# EAGLE design Rear ECU rev6 (EAGLE 9.1.3)
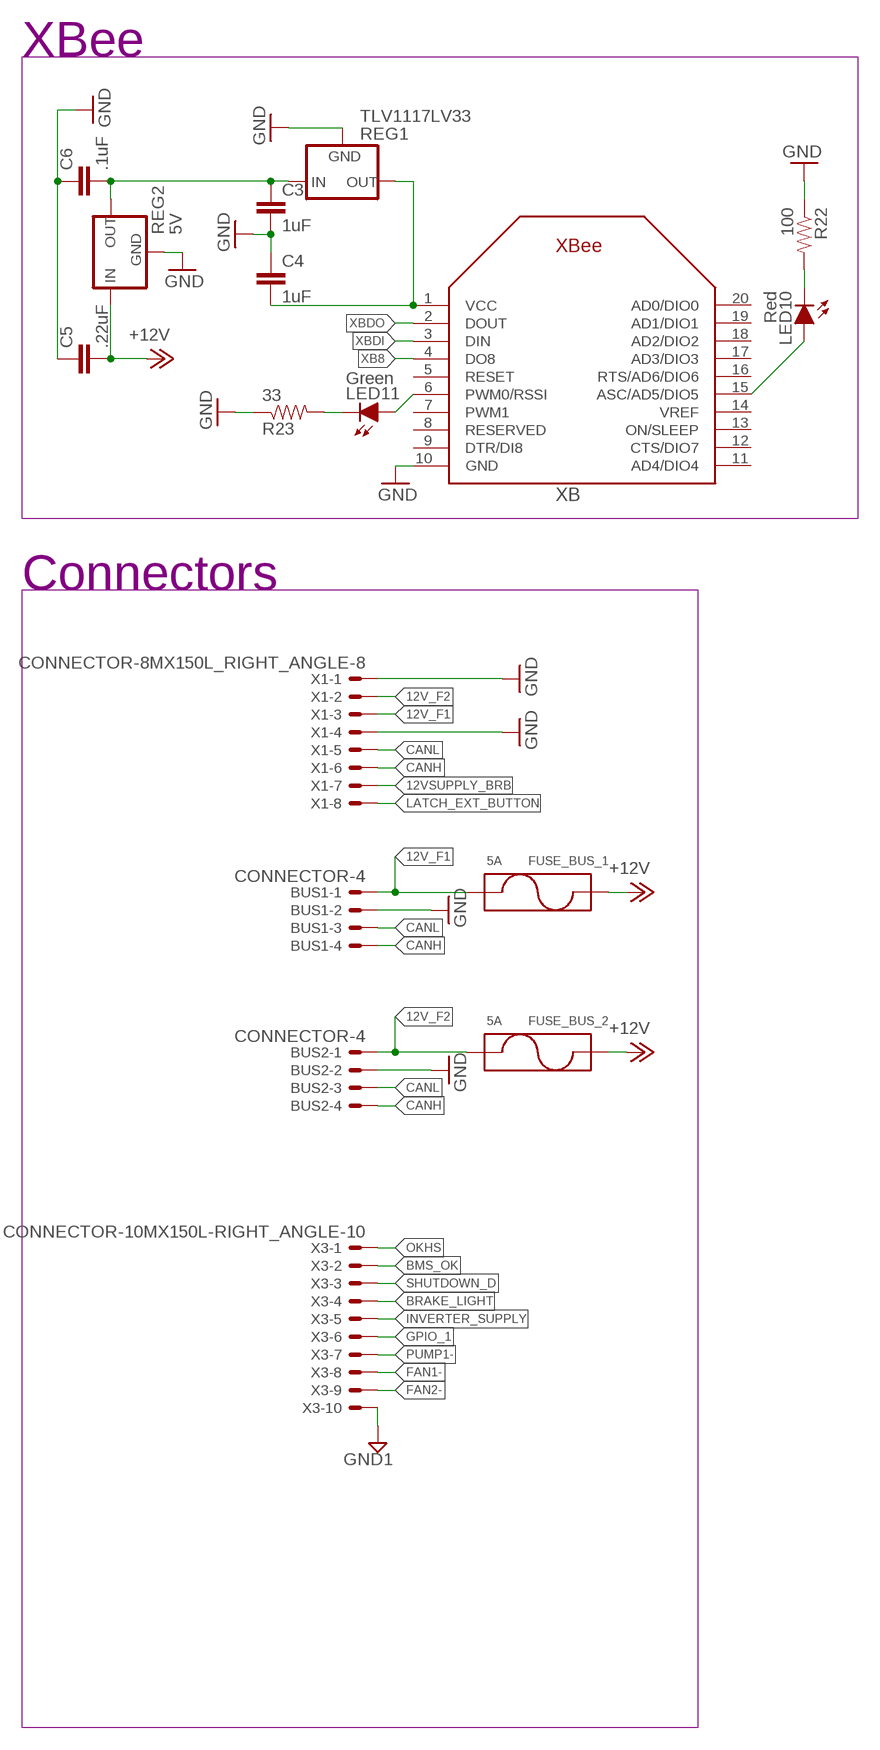
[diagram p0: schematic, sheet 1, part 1 of 2]
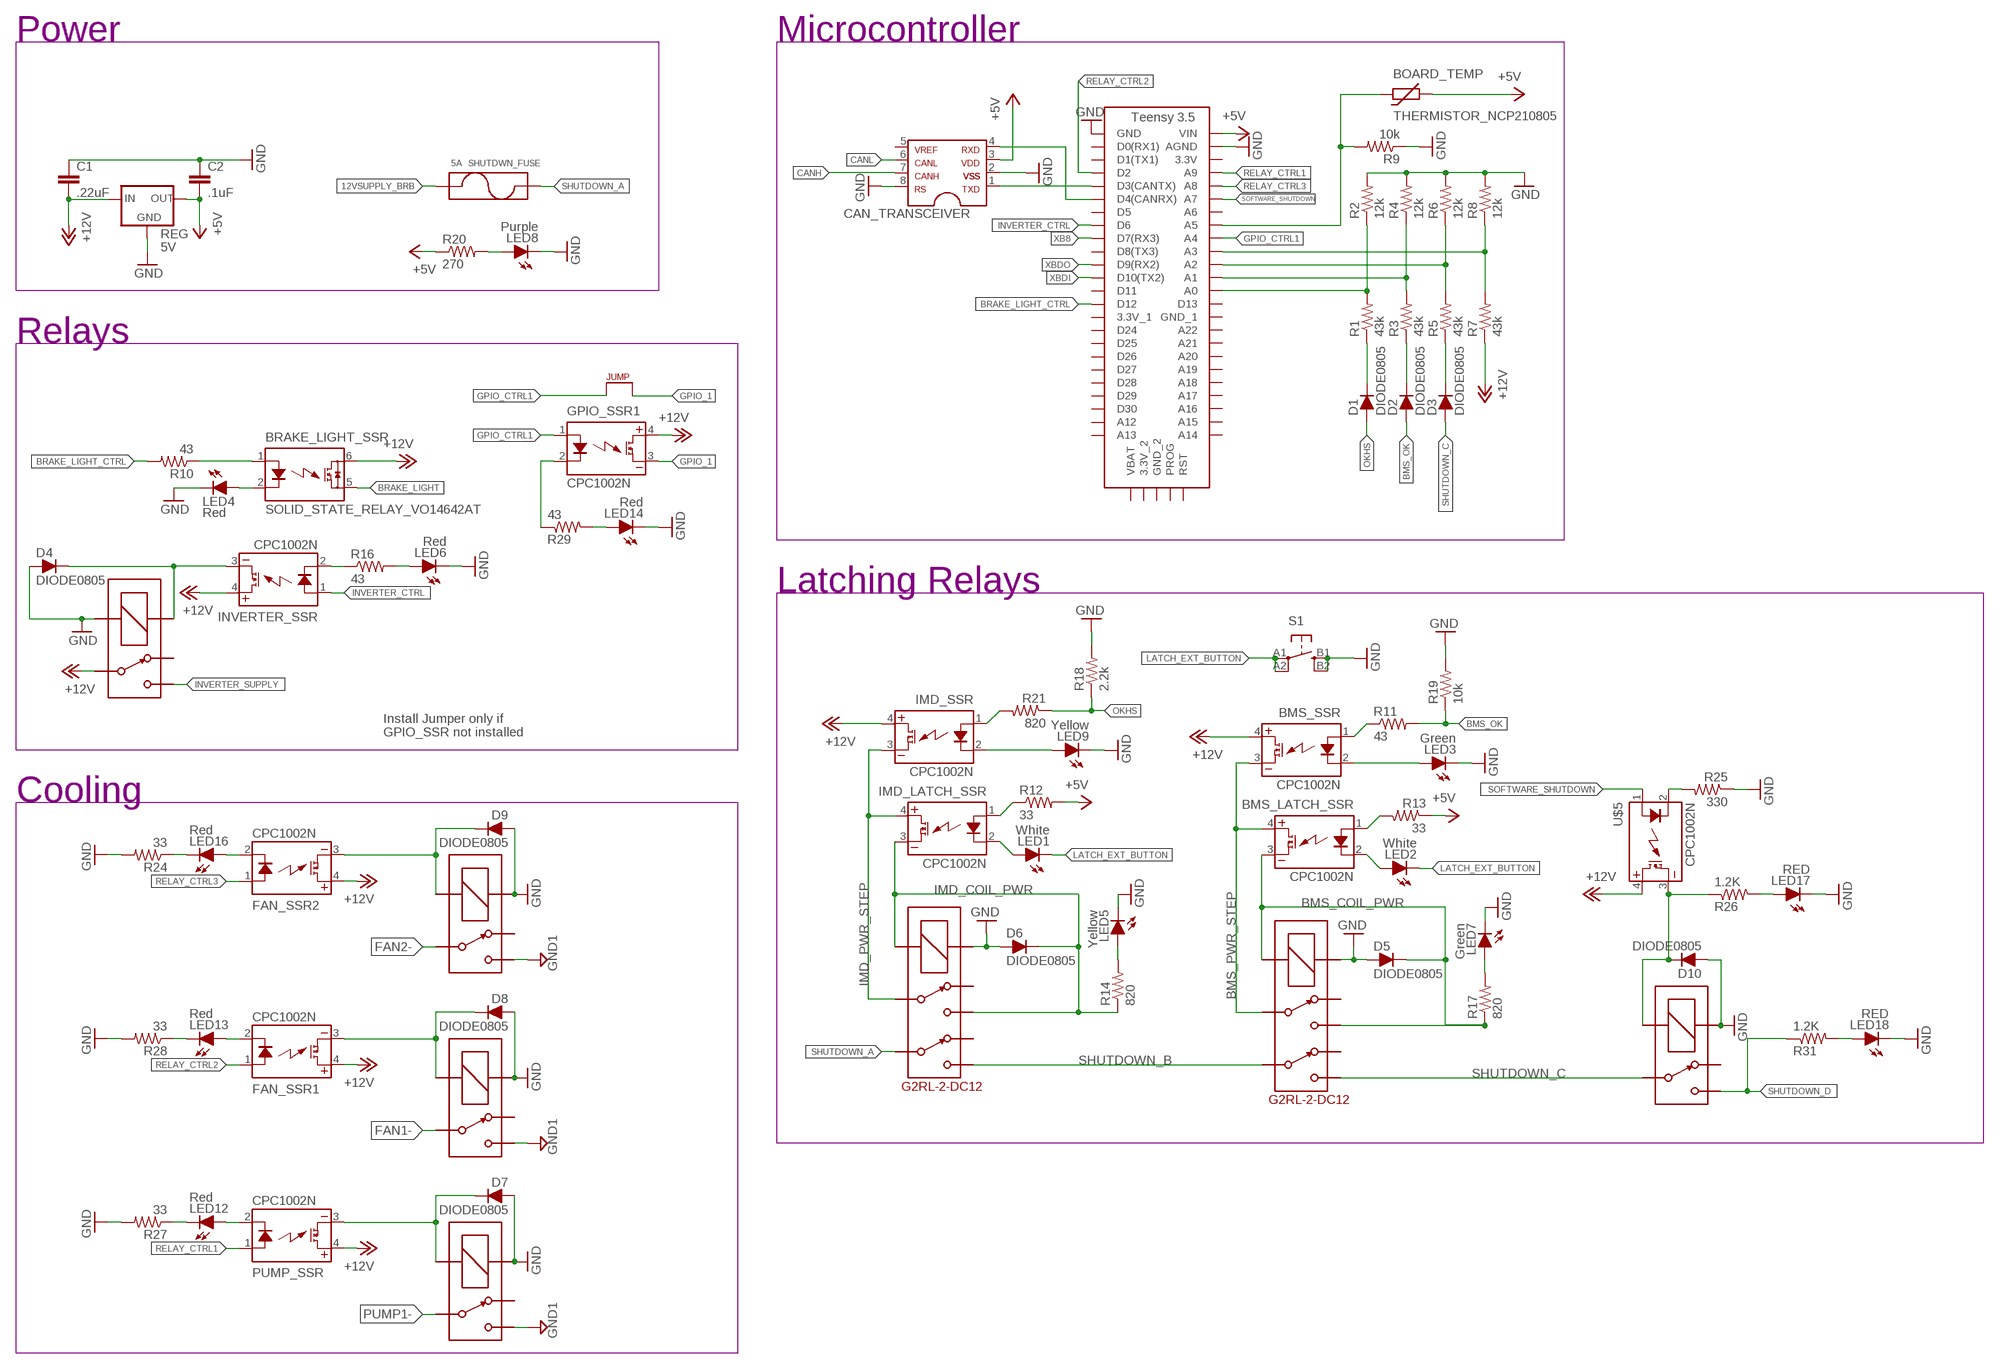
[diagram p1: schematic, sheet 1, part 2 of 2]

## Parts
BMS_LATCH_SSR  CPC1002N  [SOP04]
BMS_SSR  CPC1002N  [SOP04]
BOARD_TEMP  THERMISTOR_NCP210805  [0805]
BRAKE_LIGHT_SSR  SOLID_STATE_RELAY_VO14642AT  [DIL06]
BUS1  CONNECTOR-4  [MINIFIT_5566-4]
BUS2  CONNECTOR-4  [MINIFIT_5566-4]
C1  .22uF  CAP0805  [0805]
C2  .1uF  CAP0805  [0805]
C3  1uF  CAP0805  [0805]
C4  1uF  CAP0805  [0805]
C5  .22uF  CAP0805  [0805]
C6  .1uF  CAP0805  [0805]
CAN_TRANSCEIVER  MCP2551  [SOIC-08]
D1  DIODE0805  [0805_D]
D2  DIODE0805  [0805_D]
D3  DIODE0805  [0805_D]
D4  DIODE0805  [0805_D]
D5  DIODE0805  [0805_D]
D6  DIODE0805  [0805_D]
D7  DIODE0805  [0805_D]
D8  DIODE0805  [0805_D]
D9  DIODE0805  [0805_D]
D10  DIODE0805  [0805_D]
FAN_SSR1  CPC1002N  [SOP04]
FAN_SSR2  CPC1002N  [SOP04]
FUSE_BUS_1  5A  FUSE_MINIBLADE  [MINI-BLADE_FUSE_HOLDER]
FUSE_BUS_2  5A  FUSE_MINIBLADE  [MINI-BLADE_FUSE_HOLDER]
GPIO_SSR1  CPC1002N  [SOP04]
IMD_LATCH_SSR  CPC1002N  [SOP04]
IMD_SHUTDOWN  G2RL-2-DC12  [G2RL-2]
IMD_SHUTDOWN1  G2RL-2-DC12  [G2RL-2]
IMD_SSR  CPC1002N  [SOP04]
INVERTER_SSR  CPC1002N  [SOP04]
LED1  White  LED-0805  [LED-805]
LED2  White  LED-0805  [LED-805]
LED3  Green  LED-0805  [LED-805]
LED4  Red  LED-0805  [LED-805]
LED5  Yellow  LED-0805  [LED-805]
LED6  Red  LED-0805  [LED-805]
LED7  Green  LED-0805  [LED-805]
LED8  Purple  LED-0805  [LED-805]
LED9  Yellow  LED-0805  [LED-805]
LED10  Red  LED-0805  [LED-805]
LED11  Green  LED-0805  [LED-805]
LED12  Red  LED-0805  [LED-805]
LED13  Red  LED-0805  [LED-805]
LED14  Red  LED-0805  [LED-805]
LED16  Red  LED-0805  [LED-805]
LED17  RED  LED-0805  [LED-805]
LED18  RED  LED-0805  [LED-805]
PUMP_SSR  CPC1002N  [SOP04]
R1  43k  RESISTOR0805-RES  [0805]
R2  12k  RESISTOR0805-RES  [0805]
R3  43k  RESISTOR0805-RES  [0805]
R4  12k  RESISTOR0805-RES  [0805]
R5  43k  RESISTOR0805-RES  [0805]
R6  12k  RESISTOR0805-RES  [0805]
R7  43k  RESISTOR0805-RES  [0805]
R8  12k  RESISTOR0805-RES  [0805]
R9  10k  RESISTOR0805-RES  [0805]
R10  43  RESISTOR0805-RES  [0805]
R11  43  RESISTOR0805-RES  [0805]
R12  33  RESISTOR0805-RES  [0805]
R13  33  RESISTOR0805-RES  [0805]
R14  820  RESISTOR0805-RES  [0805]
R16  43  RESISTOR0805-RES  [0805]
R17  820  RESISTOR0805-RES  [0805]
R18  2.2k  RESISTOR0805-RES  [0805]
R19  10k  RESISTOR0805-RES  [0805]
R20  270  RESISTOR0805-RES  [0805]
R21  820  RESISTOR0805-RES  [0805]
R22  100  RESISTOR0805-RES  [0805]
R23  33  RESISTOR0805-RES  [0805]
R24  33  RESISTOR0805-RES  [0805]
R25  330  RESISTOR0805-RES  [0805]
R26  1.2K  RESISTOR0805-RES  [0805]
R27  33  RESISTOR0805-RES  [0805]
R28  33  RESISTOR0805-RES  [0805]
R29  43  RESISTOR0805-RES  [0805]
R31  1.2K  RESISTOR0805-RES  [0805]
REG  5V  5V_REGULATOR_LM340-NLM340MPX-5.0/NOPB  [SOT223]
REG1  TLV1117LV33  [SOT223]
REG2  5V  5V_REGULATOR_LM340-NLM340MPX-5.0/NOPB  [SOT223]
S1  BTN_10-XXSMD  [TACTILE_SWITCH_SMD_6.2MM_TALL]
SHUTDWN_FUSE  5A  FUSE_MINIBLADE  [MINI-BLADE_FUSE_HOLDER]
SOFTWARE_SHUTOFF  G5LE  [ZF112]
U$1  G5LE  [ZF112]
U$2  G5LE  [ZF112]
U$4  TEENSY_3.5_EXT  [TEENSY_3.5_EXT]
U$5  CPC1002N  [SOP04]
U$6  G5LE  [ZF112]
U$7  G5LE  [ZF112]
U$10  JUMPER  [0805]
X1  CONNECTOR-8MX150L_RIGHT_ANGLE-8  [MX150L_RIGHT_ANGLE-8]
X3  CONNECTOR-10MX150L-RIGHT_ANGLE-10  [MX150L_RIGHT_ANGLE-10]
XB  XBEE  [XBEE]

## Nets
12V_F1: BUS1.1 FUSE_BUS_1.R1(P2) FUSE_BUS_1.R2(P2) X1.3
12V_F2: BUS2.1 FUSE_BUS_2.R1(P2) FUSE_BUS_2.R2(P2) X1.2
12VSUPPLY_BRB: SHUTDWN_FUSE.R1(P2) SHUTDWN_FUSE.R2(P2) X1.7
12VSUPPLY_READ: R7.2 R8.1 U$4.A3
+5V: BOARD_TEMP.1 C2.2 CAN_TRANSCEIVER.3 R12.2 R13.1 R20.1 REG.3(OUT) U$4.VIN
+12V: BMS_SSR.4(DC+) BRAKE_LIGHT_SSR.6(IO1) C1.2 C5.2 FAN_SSR1.4(DC+) FAN_SSR2.4(DC+) FUSE_BUS_1.L1(P1) FUSE_BUS_1.L2(P1) FUSE_BUS_2.L1(P1) FUSE_BUS_2.L2(P1) GPIO_SSR1.4(DC+) IMD_SSR.4(DC+) INVERTER_SSR.4(DC+) PUMP_SSR.4(DC+) R7.1 REG2.1(IN) REG.1(IN) U$1.P U$5.4(DC+)
BMS_COIL_PWR: BMS_LATCH_SSR.3(DC-) D5.C IMD_SHUTDOWN1.4 IMD_SHUTDOWN1.COIL- R17.1
BMS_OK: D2.A R11.2 R19.1 X3.2
BMS_OK_READ: R3.2 R4.1 U$4.A1
BMS_PWR_STEP: BMS_LATCH_SSR.4(DC+) BMS_SSR.3(DC-) IMD_SHUTDOWN1.3
BRAKE_LIGHT: BRAKE_LIGHT_SSR.5(IO2) X3.4
BRAKE_LIGHT_CTRL: R10.2 U$4.D12
CANH: BUS1.4 BUS2.4 CAN_TRANSCEIVER.7 X1.6
CANL: BUS1.3 BUS2.3 CAN_TRANSCEIVER.6 X1.5
FAN1-: U$7.P X3.8
FAN2-: U$2.P X3.9
GND: BUS1.2 BUS2.2 C1.1 C2.1 C3.2 C4.1 C5.1 C6.1 CAN_TRANSCEIVER.2 CAN_TRANSCEIVER.8 D4.A D5.A D6.A D7.A D8.A D9.A D10.A IMD_SHUTDOWN1.COIL+ IMD_SHUTDOWN.COIL+ LED3.C LED4.C LED5.C LED6.C LED7.C LED8.C LED9.C LED14.C LED17.C LED18.C R2.2 R4.2 R6.2 R8.2 R9.1 R18.2 R19.2 R22.1 R23.1 R24.2 R25.1 R27.2 R28.2 REG1.1(GND) REG2.2(GND) REG2.4(GND) REG.2(GND) REG.4(GND) S1.B1(S) S1.B2(S1) SOFTWARE_SHUTOFF.1(COIL+) U$1.2(COIL-) U$2.1(COIL+) U$4.AGND U$4.GND U$6.1(COIL+) U$7.1(COIL+) X1.1 X1.4 XB.10(GND)
GND1: U$2.S U$6.S U$7.S X3.10
GPIO_1: GPIO_SSR1.3(DC-) U$10.2 X3.6
GPIO_CTRL1: GPIO_SSR1.1(CONTROL+) U$4.A4 U$10.1
IMD_COIL_PWR: D6.C IMD_LATCH_SSR.3(DC-) IMD_SHUTDOWN.4 IMD_SHUTDOWN.COIL- R14.1
IMD_PWR_STEP: IMD_LATCH_SSR.4(DC+) IMD_SHUTDOWN.3 IMD_SSR.3(DC-)
INVERTER_CTRL: INVERTER_SSR.1(CONTROL+) U$4.D6
INVERTER_SUPPLY: U$1.S X3.5
LATCH_EXT_BUTTON: LED1.C LED2.C S1.A1(P) S1.A2(P1) X1.8
N$1: IMD_LATCH_SSR.2(CONTROL-) LED1.A
N$2: CAN_TRANSCEIVER.4 U$4.D4(CANRX)
N$3: CAN_TRANSCEIVER.1 U$4.D3(CANTX)
N$4: D7.C PUMP_SSR.3(DC-) U$6.2(COIL-)
N$5: IMD_LATCH_SSR.1(CONTROL+) R12.1
N$6: GPIO_SSR1.2(CONTROL-) R29.1
N$7: BRAKE_LIGHT_SSR.2(LED-) LED4.A
N$9: BMS_SSR.2(CONTROL-) LED3.A
N$10: LED10.A XB.15(ASC/AD5/DIO5)
N$11: LED10.C R22.2
N$12: BMS_LATCH_SSR.1(CONTROL+) R13.2
N$13: LED14.A R29.2
N$15: BOARD_TEMP.2 R9.2 U$4.A5
N$16: BMS_LATCH_SSR.2(CONTROL-) LED2.A
N$17: BRAKE_LIGHT_SSR.1(LED+) R10.1
N$18: BMS_SSR.1(CONTROL+) R11.1
N$19: LED5.A R14.2
N$20: D8.C FAN_SSR1.3(DC-) U$7.2(COIL-)
N$21: D9.C FAN_SSR2.3(DC-) U$2.2(COIL-)
N$22: D1.C R1.1
N$23: D2.C R3.1
N$24: D3.C R5.1
N$25: LED11.A XB.6(PWM0/RSSI)
N$26: D4.C INVERTER_SSR.3(DC-) U$1.1(COIL+)
N$27: INVERTER_SSR.2(CONTROL-) R16.1
N$28: LED6.A R16.2
N$29: LED8.A R20.2
N$30: LED16.C R24.1
N$31: IMD_SSR.1(CONTROL+) R21.2
N$32: LED7.A R17.2
N$33: LED11.C R23.2
N$34: IMD_SSR.2(CONTROL-) LED9.A
N$35: C3.1 C6.2 REG1.3(IN) REG2.3(OUT)
N$36: LED13.C R28.1
N$37: LED12.C R27.1
N$38: LED12.A PUMP_SSR.2(CONTROL-)
N$39: FAN_SSR2.2(CONTROL-) LED16.A
N$40: LED18.A R31.2
N$42: FAN_SSR1.2(CONTROL-) LED13.A
N$43: D10.C R26.1 SOFTWARE_SHUTOFF.2(COIL-) U$5.3(DC-)
N$44: R25.2 U$5.2(CONTROL-)
N$46: LED17.A R26.2
OKHS: D1.A R18.1 R21.1 X3.1
OKHS_READ: R1.2 R2.1 U$4.A0
PUMP1-: U$6.P X3.7
RELAY_CTRL1: PUMP_SSR.1(CONTROL+) U$4.A9
RELAY_CTRL2: FAN_SSR1.1(CONTROL+) U$4.D2
RELAY_CTRL3: FAN_SSR2.1(CONTROL+) U$4.A8
SHUTDOWN_A: IMD_SHUTDOWN.6 SHUTDWN_FUSE.L1(P1) SHUTDWN_FUSE.L2(P1)
SHUTDOWN_B: IMD_SHUTDOWN1.6 IMD_SHUTDOWN.5
SHUTDOWN_C: D3.A IMD_SHUTDOWN1.5 SOFTWARE_SHUTOFF.P
SHUTDOWN_D: R31.1 SOFTWARE_SHUTOFF.S X3.3
SHUTDOWN_OUT_READ: R5.2 R6.1 U$4.A2
SOFTWARE_SHUTDOWN: U$4.A7 U$5.1(CONTROL+)
VCC: C4.2 REG1.2(OUT) REG1.4(OUT) XB.1(VCC)
XB8: U$4.D7(RX3) XB.4(DO8)
XBDI: U$4.D10(TX2) XB.3(DIN)
XBDO: U$4.D9(RX2) XB.2(DOUT)
Unconnected: CAN_TRANSCEIVER.5 IMD_SHUTDOWN1.2 IMD_SHUTDOWN1.7 IMD_SHUTDOWN.2 IMD_SHUTDOWN.7 SOFTWARE_SHUTOFF.O U$1.O U$2.O U$4.3.3V U$4.3.3V_1 U$4.3.3V_2 U$4.A6 U$4.A12 U$4.A13 U$4.A14 U$4.A15 U$4.A16 U$4.A17 U$4.A18 U$4.A19 U$4.A20 U$4.A21 U$4.A22 U$4.D0(RX1) U$4.D1(TX1) U$4.D5 U$4.D8(TX3) U$4.D11 U$4.D13 U$4.D24 U$4.D25 U$4.D26 U$4.D27 U$4.D28 U$4.D29 U$4.D30 U$4.GND_1 U$4.GND_2 U$4.PROG U$4.RST U$4.VBAT U$6.O U$7.O XB.5(RESET) XB.7(PWM1) XB.8(RESERVED) XB.9(DTR/DI8) XB.11(AD4/DIO4) XB.12(CTS/DIO7) XB.13(ON/SLEEP) XB.14(VREF) XB.16(RTS/AD6/DIO6) XB.17(AD3/DIO3) XB.18(AD2/DIO2) XB.19(AD1/DIO1) XB.20(AD0/DIO0)

## Notes on the sheet
- XBee | Power | Microcontroller
- Relays
- Connectors
- Latching Relays
- Install Jumper only if
  GPIO_SSR not installed
- Cooling

## Library data of the parts
BMS_LATCH_SSR BMS_SSR FAN_SSR1 FAN_SSR2 GPIO_SSR1 IMD_LATCH_SSR IMD_SSR INVERTER_SSR PUMP_SSR U$5 = HyTechDevices:CPC1002N: IXYS Solid State Relay .7A
BOARD_TEMP = HyTechDevices:THERMISTOR_NCP21: Murata NCP Thermistor Datasheet <http://www.murata.com/~/media/webrenewal/support/library/catalog/products/thermistor/ntc/r44e.ashx>
BRAKE_LIGHT_SSR = HyTechDevices:SOLID_STATE_RELAY
BUS1 BUS2 = HyTechDevices:CONNECTOR-4: Mini-Fit Junior connector 4 pole Source: http://www.molex.com; OC_FARNELL: unknown; OC_NEWARK: unknown
C1-C6 = HyTechDevices:CAP: Capacitor Standard 0603 ceramic capacitor, and 0.1" leaded capacitor.
CAN_TRANSCEIVER = HyTechDevices:MCP2551: MCP2551 High-Speed CAN Transceiver Product Webpage <https://www.microchip.com/wwwproducts/en/MCP2551> Datasheet <http://ww1.microchip.com/downloads/en/DeviceDoc/21667f.pdf> This device is outdated It is replaced by MCP2561. Comparison Page <https://www.microchip.com/wwwproducts/ProductCompare/MCP2551/MCP2561> Product Webpage <https://www.microchip.com/wwwproducts/en/MCP2561> Datasheet <http://ww1.microchip.com/downloads/en/DeviceDoc/20005167C.pdf>
D1-D10 = HyTechDevices:DIODE: DIODE general purpose rectifier
FUSE_BUS_1 FUSE_BUS_2 SHUTDWN_FUSE = HyTechDevices:FUSE: Fuse/Fuseclips Keystone Electronics 3568 Fuse Mouser Part <http://www.mouser.com/ProductDetail/Keystone-Electronics/3568> Datasheet <http://www.mouser.com/ds/2/215/568-742601.pdf> Bussman/Eaton Midget Fuse Clip 1A3400 <http://www.mouser.com/ProductDetail/Bussmann-Eaton/BK-1A3400-09-R/?qs=sGAEpiMZZMuG%252bgnN5hGYGzzlAelq2OxnKqVSMVjq8I4%3d> Schurter 0751.0110 Brass Fuse Clip Datasheet <http://www.mouser.com/ds/2/358/typ_OG__Clip__5x20-2553.pdf>
IMD_SHUTDOWN IMD_SHUTDOWN1 = HyTechDevices:G2RL-2-DC12: Omron G2RL-2 Double Pull Double Throw Relay Coil Voltage: 12VDC (8.4-18VDC @60ºC) Contact Amperage: 8A at 30VDC Datasheet <https://www.omron.com/ecb/products/pdf/en-g2rl.pdf>
LED1-LED14 LED16-LED18 = HyTechDevices:LED: Light Emitting Diode (LED) Source: Dangerous Prototypes Eagle Library <https://github.com/DangerousPrototypes/Eagle_Part_Library>
R1-R14 R16-R29 R31 = HyTechDevices:RESISTOR: Resistor Basic schematic elements and footprints for 0603, 1206, and PTH resistors.
REG REG2 = HyTechDevices:5V_REGULATOR_LM340-N: Voltage Regulator 5v linear voltage regulator Datasheet <http://www.mouser.com/ProductDetail/Texas-Instruments/LM340MPX-50-NOPB/?qs=X1J7HmVL2ZGZwtTFRQ9ItA%3D%3D> MAX current out: 1.5A MAX voltage in: 35V
REG1 = HyTechDevices:TLV1117LV33: Texas Instruments TLV1117LV33 3.3V Linear Regulator
S1 = HyTechDevices:BTN_10-XX: Small momentary tactile push button
SOFTWARE_SHUTOFF U$1 U$2 U$6 U$7 = HyTechDevices:G5LE: Omron G5LE SPST Relay 5 VDC, 12VDC, 24VDC models Coil voltage: 75% - 170% of nominal voltage Datasheet <https://www.omron.com/ecb/products/pdf/en-g5le.pdf>
U$4 = HyTechDevices:TEENSY_3.5_EXT: Simple version of the Teensy 3.5 board that only uses the 2 main rows of pins, plus the perpendicular row with VBat.
U$10 = HyTechDevices:JUMPER: Jumper for changing operation of a device
X1 = HyTechDevices:CONNECTOR-8: Mini-Fit Junior connector 8 pole Source: http://www.molex.com
X3 = HyTechDevices:CONNECTOR-10: Mini-Fit Junior connector 10 pole Source: http://www.molex.com
XB = HyTechDevices:XBEE: Source: Adafruit <https://github.com/adafruit/Adafruit-Eagle-Library>

## Board
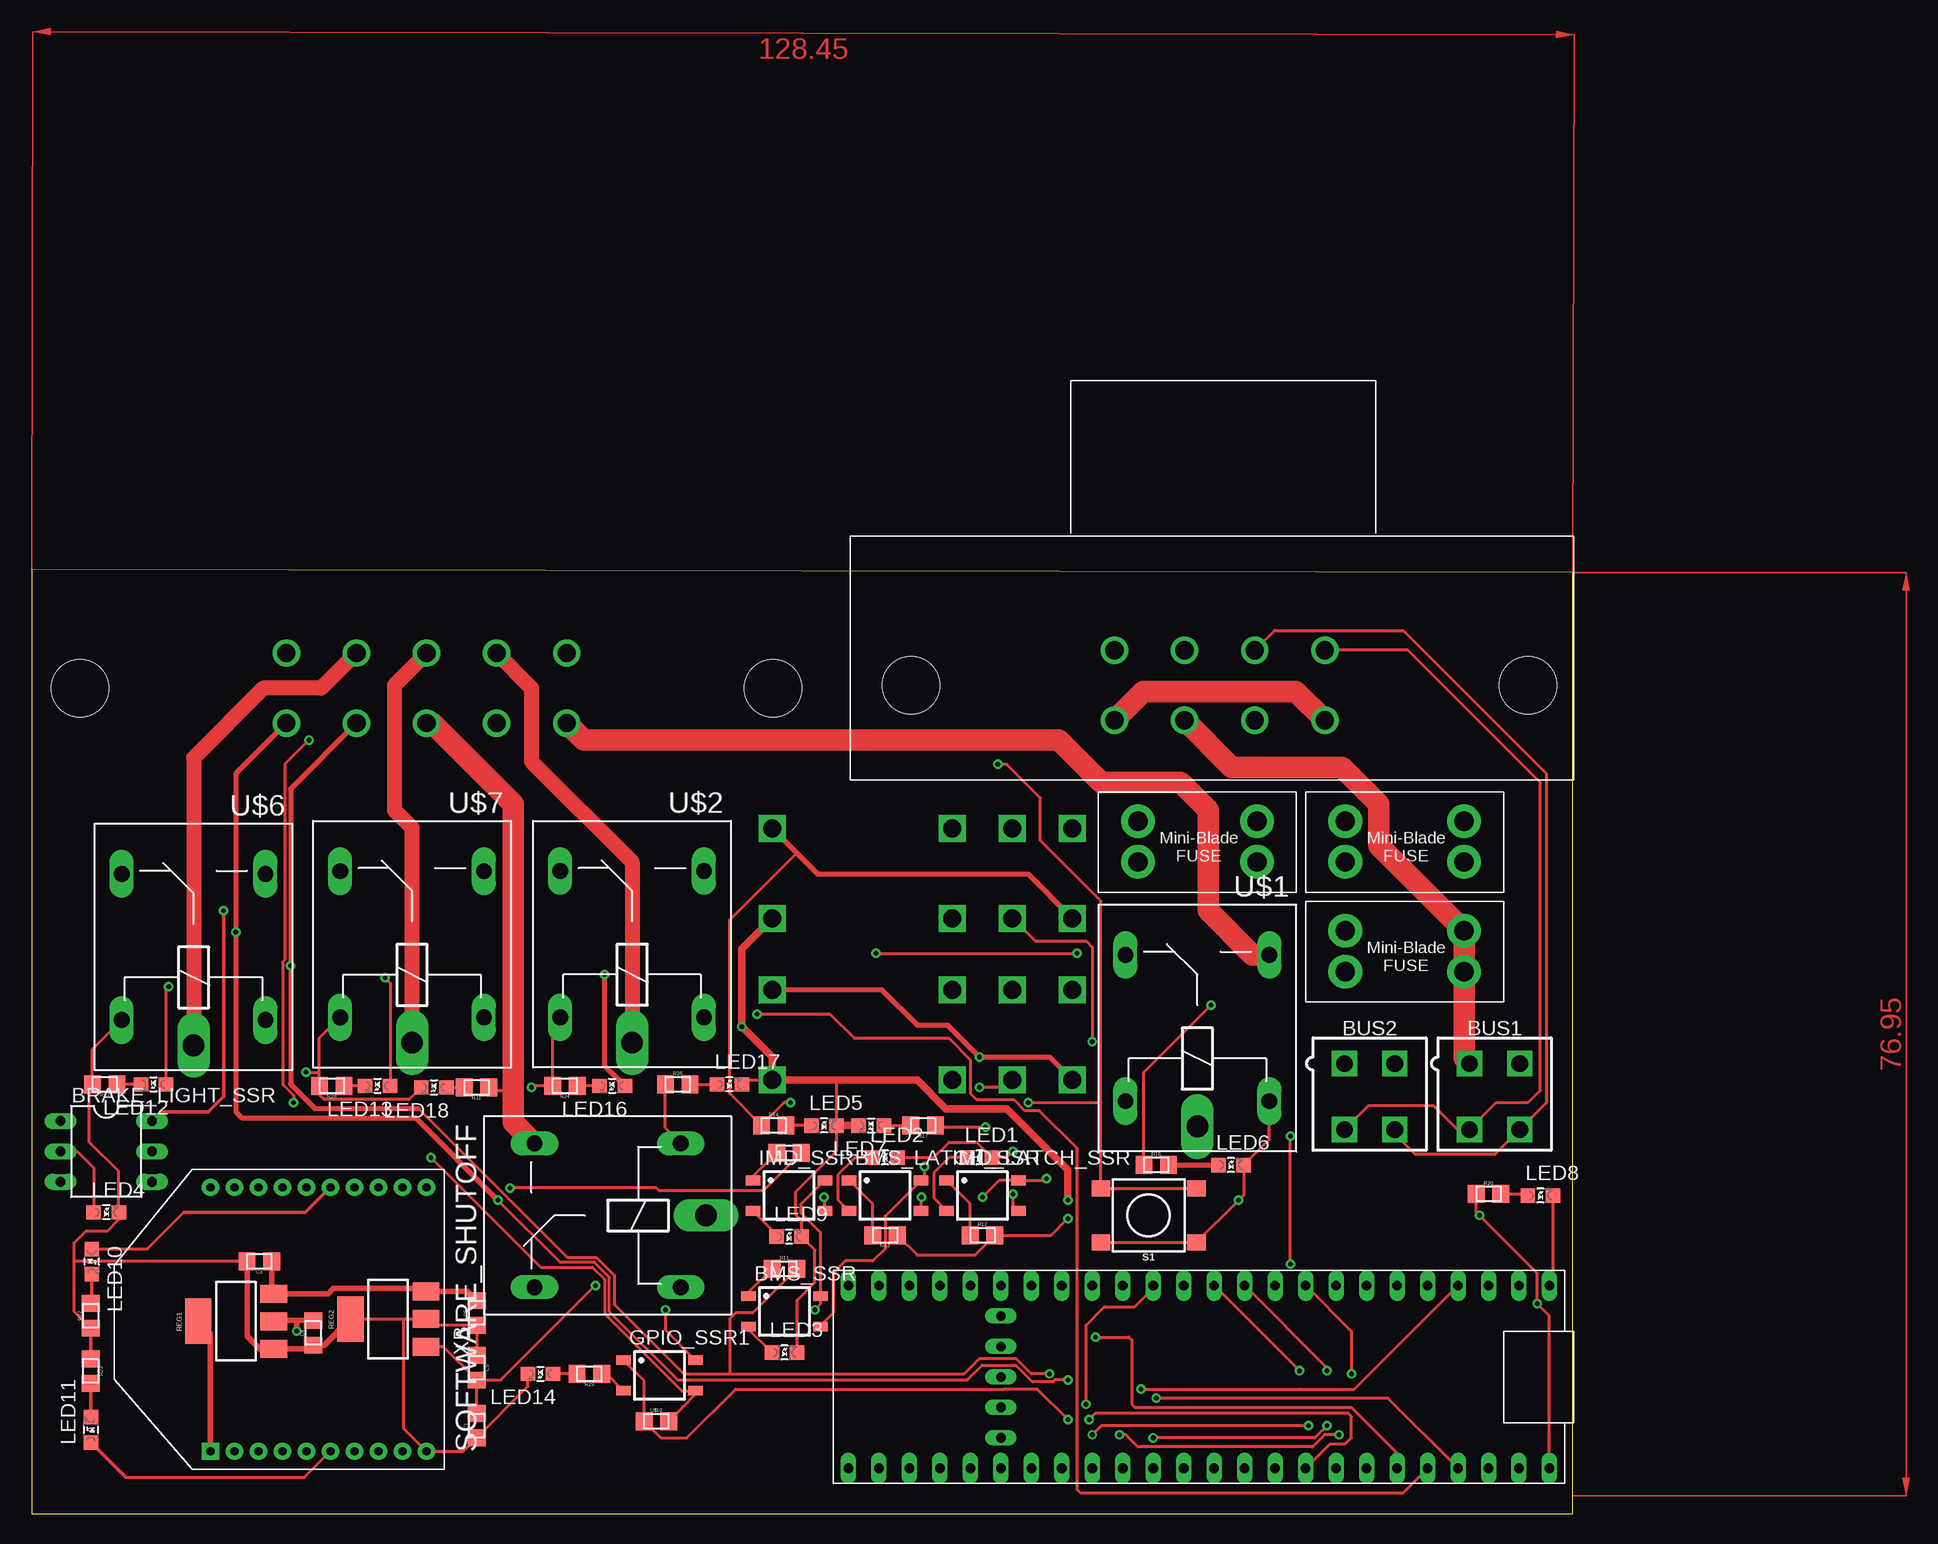
[diagram p2: board, top side]
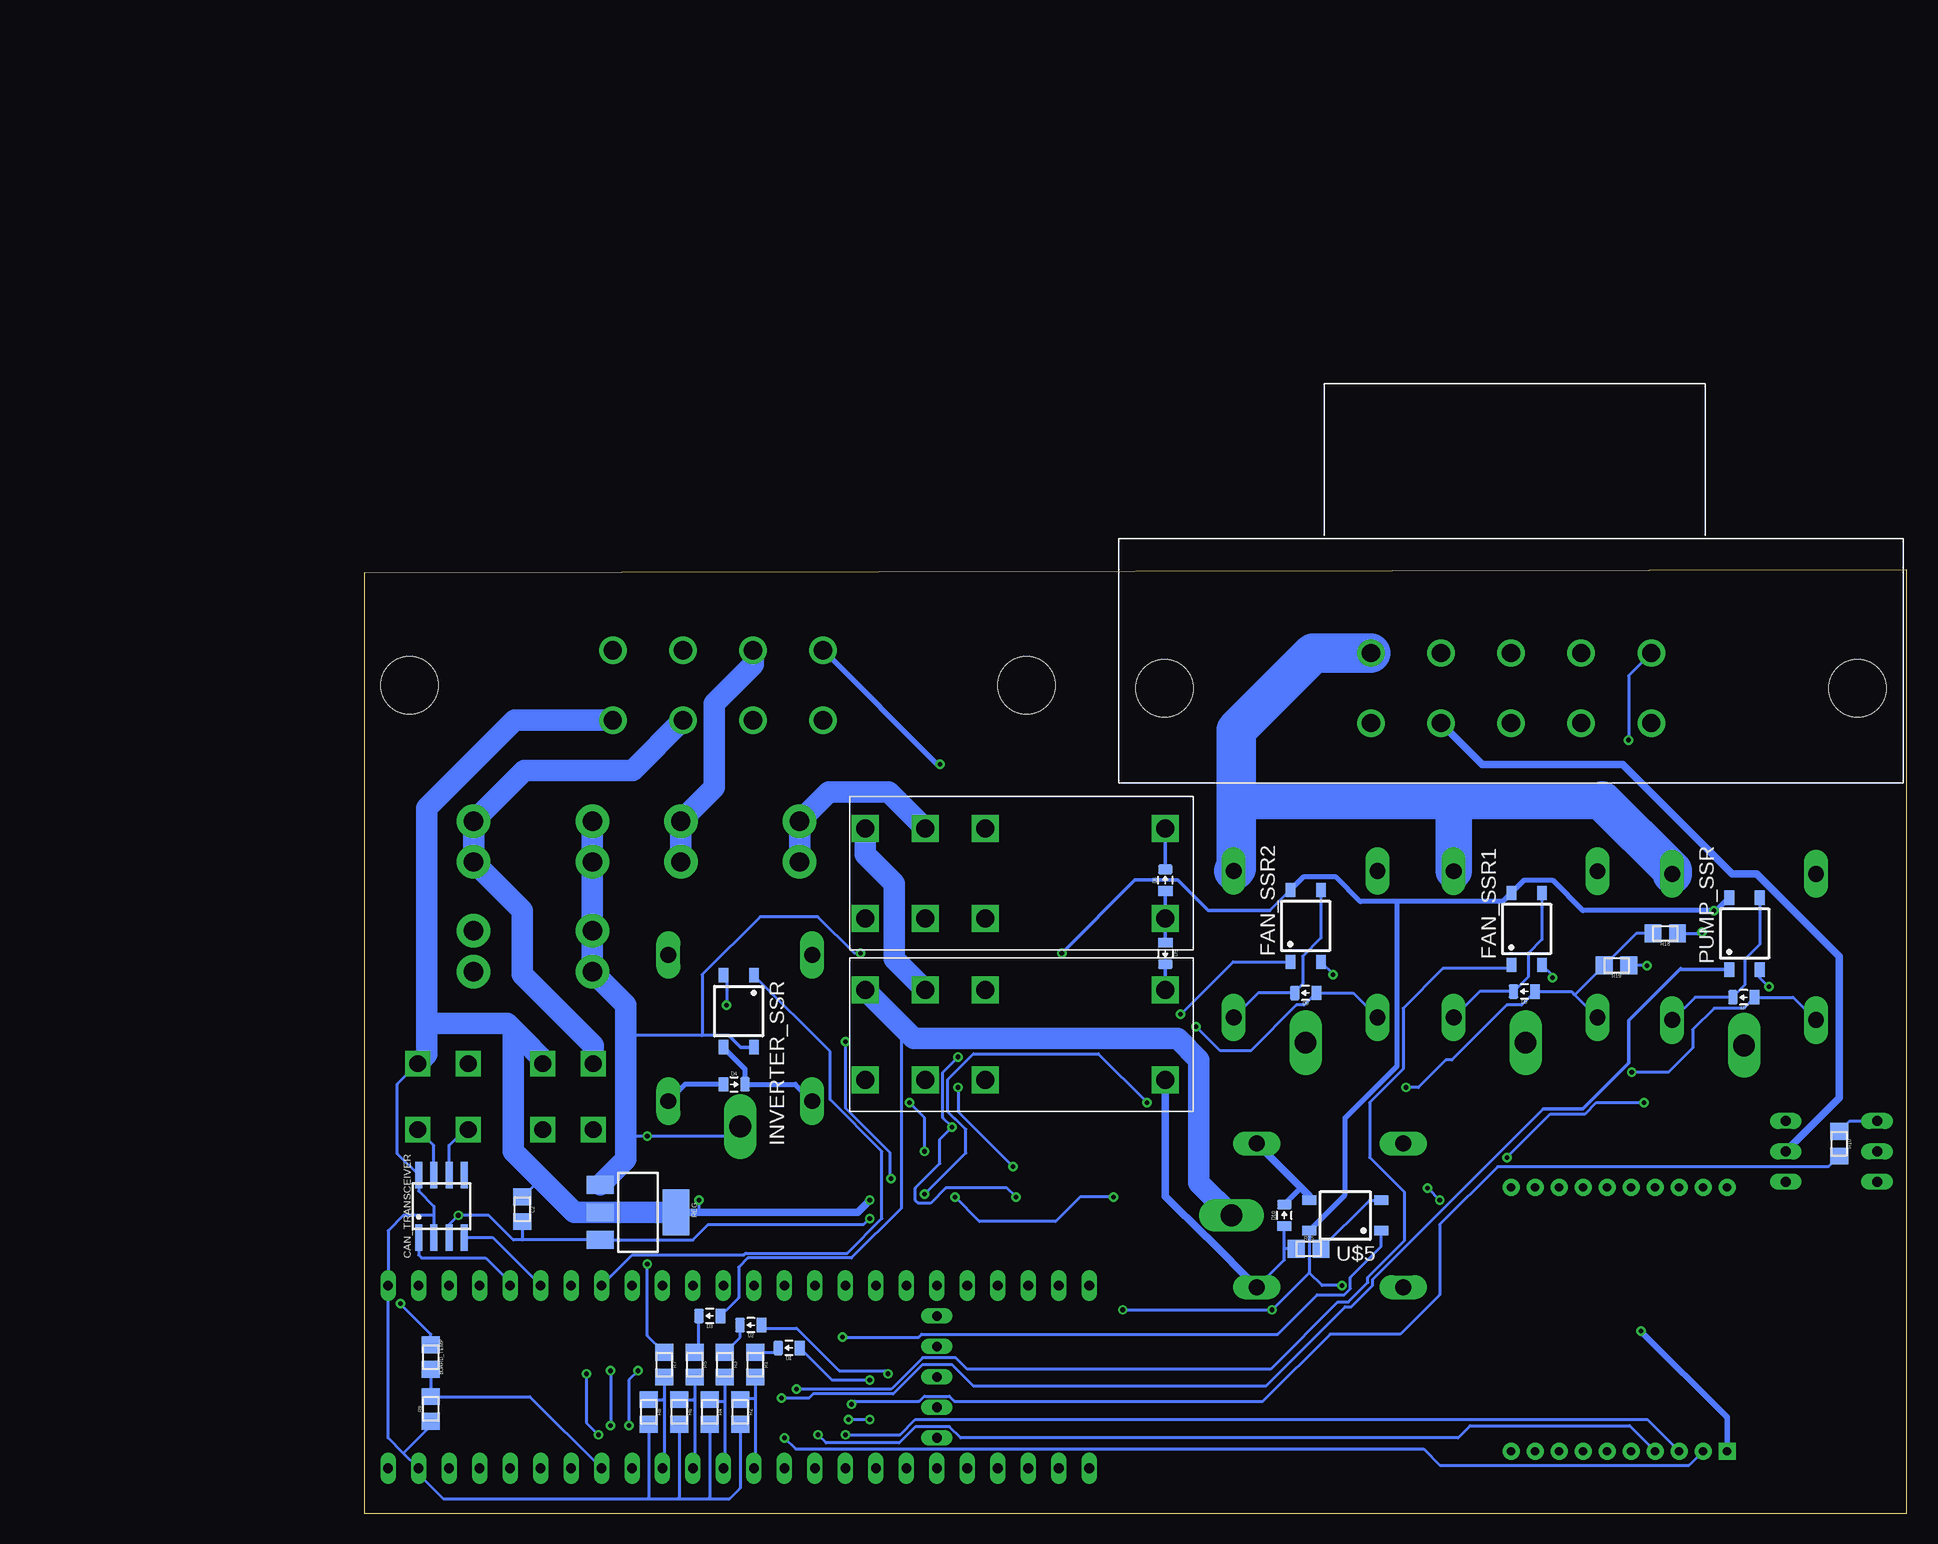
[diagram p3: board, bottom side, seen from below]

Size 128.45 x 78.73 mm. Coordinates in mm from the lower left corner, seen from the top.
Outline: 0,0 128.45,0 128.45,78.48 0,78.73 0,0
Copper layers (1*16): Top 0.035mm / dielectric 1.5mm / Bottom 0.035mm
Design rules "DRC Advanced Circuits": minimum track width 6mil, minimum drill 15mil, track to track 6mil, track to pad 6mil, pad to pad 6mil, via to via 6mil, smd to smd 6mil, copper to edge 40mil, drill to drill 6mil, minimum pad ring 10mil, minimum via ring 8mil, stop-mask expansion 4mil, vias tented up to drill 0mil, thermal gap 10mil

### Footprints (pad centres in the part's own frame; a part is rotated, then mirrored left to right if it is on the bottom)
SOP04 = smd 0.8 x 1.2: 1 -1.27,-3; 2 1.27,-3; 3 1.27,3; 4 -1.27,3
0805 = smd 1.4 x 1.5: 1 -1.025,0; 2 1.025,0
DIL06 = drill 0.813 long: 1 -2.54,-3.81; 2 0,-3.81; 3 2.54,-3.81; 4 2.54,3.81; 5 0,3.81; 6 -2.54,3.81
MINIFIT_5566-4 = drill 1.4 square: 1 2.1,-2.75; 2 -2.1,-2.75; 3 2.1,2.75; 4 -2.1,2.75
SOIC-08 = smd 0.6 x 2.2: 1 -1.905,-2.6; 2 -0.635,-2.6; 3 0.635,-2.6; 4 1.905,-2.6; 5 1.905,2.6; 6 0.635,2.6; 7 -0.635,2.6; 8 -1.905,2.6
0805_D = smd 0.8 x 1.2: A -0.9,0; C 0.9,0
MINI-BLADE_FUSE_HOLDER = drill 1.613 pad 2.794: L1 0,3.404; L2 0,0; R1 9.906,3.404; R2 9.906,0
G2RL-2 = drill 1.5 square: 2 10.008,0; 3 5.004,0; 4 0,0; 5 0,7.493; 6 5.004,7.493; 7 10.008,7.493; COIL+ 25.019,0; COIL- 25.019,7.493
LED-805 = smd 1.2 x 1.2: A 0,-1.05; C 0,1.05
SOT223 = smd 1.5 x 2.235: 1 -2.3,-3.15; 2 0,-3.15; 3 2.3,-3.15 | smd 3.8 x 2.2: 4 0,3.15
TACTILE_SWITCH_SMD_6.2MM_TALL = smd 1.55 x 1.3: A1 -3.975,-2.25; A2 3.975,-2.25; B1 -3.975,2.25; B2 3.975,2.25
ZF112 = drill 1.321 long: 1 4.064,14.884; 2 4.064,2.896; O 16.256,14.884; S 16.256,2.896 | drill 1.803 long: P 1.956,8.89
TEENSY_3.5_EXT = drill 0.8 long: 3.3V 16.51,54.61; 3.3V_1 1.27,24.13; 3.3V_2 6.35,13.97; A0 16.51,29.21; A1 16.51,31.75; A2 16.51,34.29; A3 16.51,36.83; A4 16.51,39.37; A5 16.51,41.91; A6 16.51,44.45; A7 16.51,46.99; A8 16.51,49.53; A9 16.51,52.07; A12 1.27,3.81; A13 1.27,1.27; A14 16.51,1.27; A15 16.51,3.81; A16 16.51,6.35; A17 16.51,8.89; A18 16.51,11.43; A19 16.51,13.97; A20 16.51,16.51; A21 16.51,19.05; A22 16.51,21.59; AGND 16.51,57.15; D0(RX1) 1.27,57.15; D1(TX1) 1.27,54.61; D2 1.27,52.07; D3(CANTX) 1.27,49.53; D4(CANRX) 1.27,46.99; D5 1.27,44.45; D6 1.27,41.91; D7(RX3) 1.27,39.37; D8(TX3) 1.27,36.83; D9(RX2) 1.27,34.29; D10(TX2) 1.27,31.75; D11 1.27,29.21; D12 1.27,26.67; D13 16.51,26.67; D24 1.27,21.59; D25 1.27,19.05; D26 1.27,16.51; D27 1.27,13.97; D28 1.27,11.43; D29 1.27,8.89; D30 1.27,6.35; GND 1.27,59.69; GND_1 16.51,24.13; GND_2 8.89,13.97; PROG 11.43,13.97; RST 13.97,13.97; VBAT 3.81,13.97; VIN 16.51,59.69
MX150L_RIGHT_ANGLE-8 = drill 1.524: 1 16.942,2.921; 2 22.784,2.921; 3 28.626,2.921; 4 34.468,2.921; 5 16.942,-2.921; 6 22.784,-2.921; 7 28.626,-2.921; 8 34.468,-2.921 | hole 4.775: 0,0; 51.41,0
MX150L_RIGHT_ANGLE-10 = drill 1.524: 1 17.196,2.921; 2 23.038,2.921; 3 28.88,2.921; 4 34.722,2.921; 5 40.564,2.921; 6 17.196,-2.921; 7 23.038,-2.921; 8 28.88,-2.921; 9 34.722,-2.921; 10 40.564,-2.921 | hole 4.775: 0,0; 57.76,0
XBEE = drill 0.7 pad 1.422 square: 1 -11,5.5 | drill 0.7 pad 1.422: 2 -11,3.5; 3 -11,1.5; 4 -11,-0.5; 5 -11,-2.5; 6 -11,-4.5; 7 -11,-6.5; 8 -11,-8.5; 9 -11,-10.5; 10 -11,-12.5; 11 11,-12.5; 12 11,-10.5; 13 11,-8.5; 14 11,-6.5; 15 11,-4.5; 16 11,-2.5; 17 11,-0.5; 18 11,1.5; 19 11,3.5; 20 11,5.5

### Placement (x,y rotation side)
BMS_LATCH_SSR  71.12,26.54 270 top
BMS_SSR  62.74,16.89 270 top
BOARD_TEMP  122.94,13.08 270 bottom
BRAKE_LIGHT_SSR  6.22,30.23 270 top
BUS1  121.92,34.8 180 top
BUS2  111.51,34.8 180 top
C1  37.08,7.37 90 top
C2  115.32,25.4 270 bottom
C3  18.98,21.04 180 top
C4  23.46,15.1 90 top
C5  37.08,12.19 270 top
C6  37.08,16.76 90 top
CAN_TRANSCEIVER  122.05,25.65 0 bottom
D1  93.09,13.84 180 bottom
D2  96.27,15.75 180 bottom
D3  99.69,16.51 180 bottom
D4  97.66,35.81 0 bottom
D5  61.72,46.74 270 bottom
D6  61.72,52.83 90 bottom
D7  13.53,43.07 180 bottom
D8  31.81,43.55 180 bottom
D9  50.04,43.43 180 bottom
D10  51.82,24.89 90 bottom
FAN_SSR1  31.62,48.77 0 bottom
FAN_SSR2  50.04,49.02 0 bottom
FUSE_BUS_1  109.47,45.21 0 top
FUSE_BUS_2  109.47,54.36 0 top
GPIO_SSR1  52.32,11.56 270 top
IMD_LATCH_SSR  79.25,26.54 270 top
IMD_SHUTDOWN  86.74,49.66 0 bottom
IMD_SHUTDOWN1  86.74,36.19 0 bottom
IMD_SSR  63.12,26.54 270 top
INVERTER_SSR  97.28,41.91 180 bottom
LED1  78.99,29.72 270 top
LED2  71.12,29.72 270 top
LED3  62.74,13.46 270 top
LED4  6.22,25.15 270 top
LED5  66.04,32.38 270 top
LED6  99.95,29.08 270 top
LED7  69.98,32.38 90 top
LED8  125.73,26.54 270 top
LED9  63.12,23.11 270 top
LED10  5.01,21.05 180 top
LED11  4.94,7.02 0 top
LED12  10.16,35.81 90 top
LED13  28.83,35.69 90 top
LED14  42.42,11.68 90 top
LED16  48.39,35.69 90 top
LED17  58.17,35.81 270 top
LED18  33.53,35.56 90 top
PUMP_SSR  13.46,48.39 0 bottom
R1  95.89,12.45 270 bottom
R2  97.16,8.51 270 bottom
R3  98.42,12.45 270 bottom
R4  99.69,8.51 270 bottom
R5  100.97,12.45 270 bottom
R6  102.23,8.51 270 bottom
R7  103.5,12.45 270 bottom
R8  104.78,8.51 270 bottom
R9  122.94,8.76 90 bottom
R10  5.59,30.86 270 bottom
R11  62.74,20.45 0 top
R12  79.25,23.24 0 top
R13  71.12,23.24 180 top
R14  61.85,32.38 0 top
R16  93.73,29.08 0 top
R17  74.3,32.38 180 top
R18  20.07,48.39 180 bottom
R19  24.13,45.72 180 bottom
R20  121.41,26.67 0 top
R21  63.12,30.1 180 top
R22  4.92,16.53 90 top
R23  4.93,11.92 270 top
R24  44.45,35.69 180 top
R25  49.78,22.1 0 bottom
R26  53.85,35.81 0 top
R27  6.1,35.81 180 top
R28  25.02,35.69 180 top
R29  46.48,11.68 180 top
R31  37.08,35.56 180 top
REG  105.66,25.15 270 bottom
REG1  17.04,16.07 90 top
REG2  29.72,16.26 90 top
S1  93.09,24.89 180 top
SHUTDWN_FUSE  92.2,54.36 0 top
SOFTWARE_SHUTOFF  58.17,33.78 180 top
U$1  106.05,30.35 90 top
U$2  58.93,37.34 90 top
U$4  66.8,20.32 270 top
U$5  46.74,24.89 90 bottom
U$6  22.39,37.11 90 top
U$7  40.59,37.33 90 top
U$10  52.07,7.75 0 top
X1  124.71,69.09 180 top
X3  4.04,68.85 180 bottom
XB  20.41,16.23 90 top

### Tracks (layer width: path | path; a pad name or v marks a point on that pad's centre or on a via)
12V_F1
  Top 1.778: X1.3 100.03,62.23 109.22,62.23 112.27,59.18 112.27,55.73 FUSE_BUS_1.R1 FUSE_BUS_1.R2 119.38,37.99 BUS1.1
12V_F2
  Bottom 1.778: X1.2 106.12,61.98 115.16,61.98 FUSE_BUS_2.R1 FUSE_BUS_2.R2 115.32,50.29 115.32,44.98 109.41,39.07 BUS2.1
12VSUPPLY_BRB
  Bottom 1.778: X1.7 96.09,70.79 99.31,67.56 99.31,60.55 SHUTDWN_FUSE.R1 SHUTDWN_FUSE.R2
12VSUPPLY_READ
  Bottom 0.254: R7.2 103.5,9.4 | 103.5,9.4 103.5,3.94 U$4.A3 | R8.1 103.64,9.53 103.5,9.4
  Bottom 0.406: R8.1 104.66,9.65
+5V  (via drill 0.38)
  Top 0.254: U$4.VIN 126.49,16.51 v125.48,17.53 125.48,20.07 v120.65,24.89 120.39,25.16 R20.1 | v86.36,24.64 84.96,23.24 R12.2 78.62,21.59 73.8,21.59 R13.1
  Bottom 0.254: 115.32,22.85 REG.3 101.11,22.85 99.82,24.13 86.87,24.13 v86.36,24.64 | 115.32,22.85 116.06,22.85 118.11,24.89 v120.65,24.89 121.41,24.13 CAN_TRANSCEIVER.3 | C2.2 115.32,22.85 | BOARD_TEMP.1 122.94,14.99 v125.48,17.53
+12V  (via drill 0.38)
  Top 0.254: C1.2 C5.2 | C5.2 34.3,13.96 REG2.1 | v70.36,46.74 v87.12,46.74 | v104.9,20.83 v104.9,31.5 | IMD_SSR.4 64.1,25.79 64.1,25.12 65.74,23.48 BMS_SSR.4 65.74,17.48 v65.28,17.02 | GPIO_SSR1.4 52.83,15.32 v52.83,17.02 | C5.2 37.09,11.18 39.12,11.18 v46.99,19.05
  Top 0.305: BRAKE_LIGHT_SSR.6 10.79,33.53 14.73,33.53 16,34.8 v16,50.29
  Bottom 0.254: FAN_SSR2.4 53.04,50.29 | 98.03,39.81 98.09,39.88 100.33,39.88 | 100.33,39.88 106.68,39.88 | 106.68,31.5 v104.9,31.5 97.97,31.5 U$1.P | v87.12,46.74 87.63,46.74 90.68,49.78 95.5,49.78 100.33,44.96 100.33,39.88 | R7.1 104.9,14.87 v104.9,20.83 | v65.28,17.02 v52.83,17.02 49.74,20.11 | v46.99,19.05 48.67,19.05 49.74,20.11 | U$5.4 49.74,22.97 49.74,22.96 49.74,21.23 49.74,20.11
  Bottom 0.305: 53.04,50.29 58.17,50.29 60.71,52.83 64.26,52.83 v70.36,46.74 | INVERTER_SSR.4 97.12,38.91 98.03,39.81
  Bottom 0.406: PUMP_SSR.4 15.83,50.29 v16,50.29 26.92,50.29 29.46,52.83 31.83,52.83 FAN_SSR1.4 33.61,51.05 42.42,51.05 | FAN_SSR2.4 50.24,53.09 47.5,53.09 45.47,51.05 42.42,51.05 | U$5.4 46.74,26.62 46.74,33.02 42.42,37.34 42.42,51.05
  Bottom 1.778: FUSE_BUS_2.L1 FUSE_BUS_2.L2 FUSE_BUS_1.L1 FUSE_BUS_1.L2 106.68,42.42 106.68,39.88 106.68,31.5 106.68,29.58 REG.1
BMS_COIL_PWR  (via drill 0.38)
  Top 0.254: BMS_LATCH_SSR.3 74.12,26.37 v74.17,26.42 | R17.1 75.45,32.26 v79.5,32.26
  Top 0.406: IMD_SHUTDOWN1.COIL- 70.87,43.69 73.79,40.77 76.33,40.77 v78.99,38.1 84.84,38.1 IMD_SHUTDOWN1.4
  Bottom 0.254: v74.17,26.42 74.93,27.18 80.01,27.18 81.28,25.91 82.3,25.91 82.55,26.16 82.55,27.18 80.52,29.21 80.52,31.24 v79.5,32.26 80.26,33.02 80.26,36.83 v78.99,38.1
  Bottom 0.305: IMD_SHUTDOWN1.COIL- D5.C
BMS_OK  (via drill 0.38)
  Top 0.254: 58.17,11.68 54.36,11.68 48.56,17.47 48.56,19.89 47.07,21.39 44.65,21.39 32.26,33.78 | 58.17,11.68 77.72,11.68 78.99,12.95 82.04,12.95 83.31,11.68 v84.84,11.68 | R11.2 60.08,16.76 58.67,16.76 58.17,16.26 58.17,11.68
  Top 0.406: 32.26,33.78 23.62,33.78 21.59,35.81 v21.59,45.72 21.59,60.44 X3.2
  Bottom 0.254: D2.A arc-90 95.11,15.49 92.45,15.49 91.51,14.56 91.51,14.55 88.9,11.94 85.09,11.94 v84.84,11.68 | v21.59,45.72 R19.1
BMS_OK_READ
  Bottom 0.254: R3.2 98.42,9.4 | 98.42,9.4 98.42,3.94 U$4.A1 | 99.56,9.4 98.42,9.4
  Bottom 0.406: R4.1 99.56,9.4
BMS_PWR_STEP  (via drill 0.38)
  Top 0.254: BMS_SSR.3 65.74,15.7 66.8,16.76 66.8,20.07 67.82,21.08 70.1,21.08 71.12,22.1 71.12,24.81 BMS_LATCH_SSR.4 74.42,28.11 v74.42,28.96 | IMD_SHUTDOWN1.3 81.1,35.56 v78.99,35.56
  Bottom 0.254: v78.99,35.56 78.99,33.53 v74.42,28.96
BRAKE_LIGHT
  Bottom 0.61: X3.4 35.31,62.48 23.62,62.48 14.48,53.34 12.45,53.34 5.59,46.48 5.59,34.67 BRAKE_LIGHT_SSR.5
BRAKE_LIGHT_CTRL  (via drill 0.38)
  Top 0.254: v87.88,9.14 87.88,15.75 89.41,17.27 91.95,17.27 93.47,18.8 U$4.D12
  Bottom 0.254: R10.2 6.47,28.96 34.04,28.96 38.86,24.13 38.86,18.29 42.16,14.99 48.01,14.99 53.47,9.52 53.59,9.4 79.31,9.4 79.73,9.82 81.81,9.82 82.24,9.4 87.63,9.4 v87.88,9.14
CANH
  Top 0.254: BUS2.4 113.61,31.68 115.32,29.97 121.94,29.97 BUS1.4 126.24,34.27 126.24,61.72 114.3,73.66 103.58,73.66 X1.6
  Bottom 0.254: CAN_TRANSCEIVER.7 122.68,30.71 BUS1.4
CANL
  Top 0.254: BUS2.3 111.39,34.04 116.84,34.04 118.83,32.05 BUS1.3 122.06,34.29 124.71,34.29 125.73,35.31 125.73,60.96 114.68,72.01 X1.5
  Bottom 0.254: BUS1.3 119.96,32.19 121.41,30.73 CAN_TRANSCEIVER.6
FAN1-
  Top 1.27: X3.8 30.23,69.08 30.23,58.67 31.62,57.28 31.7,57.2 31.7,43.69 U$7.P
FAN2-
  Top 1.27: X3.9 41.66,68.87 41.66,62.74 50.04,54.36 U$2.P
GND  (via drill 0.38)
  Top 0.254: C5.1 C6.1 33.38,15.74 REG2.2 | 23.99,36.83 R28.2 23.99,34.93 24.38,34.54 31.46,34.54 LED18.C | 23.99,36.83 23.99,39.68 U$7.1 | U$2.1 43.42,40.78 R24.2 41.78,35.69 v41.66,35.56 | R27.2 5.07,36.07 | 5.07,36.07 5.07,38.74 U$6.1 | S1.B2 S1.B1 v100.58,26.16 101,26.58 | v22.86,36.83 23.99,36.83 | 5.07,36.07 4.83,35.82 4.83,30.99 7.27,28.54 LED4.C 7.27,24.55 6.35,23.62 4.57,23.62 3.56,22.61 3.56,21.08 | LED8.C 126.78,19.34 U$4.GND | LED3.C 63.79,17.81 65.28,19.3 65.28,22 LED9.C 64.17,24.47 63.69,24.95 63.69,26.86 67.09,30.26 67.09,32.26 67.09,32.64 | LED5.C 67.09,35.97 67.31,36.19 | REG2.2 31.75,16.26 | REG2.4 30.99,16.26 | 30.99,16.26 REG2.2 | 30.99,16.26 30.99,7.15 XB.10 35.97,5.23 C1.1 41.37,10.62 LED14.C | R22.1 3.56,16.86 3.56,21.08 | 3.56,21.08 3.6,21.04 C3.2 | LED17.C 59.6,36.19 IMD_SHUTDOWN1.COIL+ | 101,26.58 LED6.C 103.15,31.23 U$1.2 | 101,26.58 101,26.57
  Top 0.305: R22.1 4.92,12.95 R23.1
  Top 0.457: REG2.4 24.39,14.07 C4.1 23.15,13.77 REG1.1 19.1,13.77 19.05,13.72 17.96,14.81 C3.2
  Top 0.61: IMD_SHUTDOWN.COIL+ 59.18,47.12 v59.18,40.64 61.72,38.1 IMD_SHUTDOWN1.COIL+ 67.31,36.19 73.79,36.19 76.2,33.78 81.28,33.78 86.36,28.7 v86.36,26.16 | 67.09,32.64 LED5.C | LED7.C 67.22,32.38 67.09,32.26
  Top 1.778: X1.4 92.66,68.58 105.36,68.58 X1.1
  Bottom 0.254: 122.68,24.89 122.68,25.65 123.95,26.92 CAN_TRANSCEIVER.8 125.73,30.03 125.73,35.84 BUS1.2 | 122.68,24.89 CAN_TRANSCEIVER.2 | 27.59,43.27 27.87,43.55 D8.A 32.04,42.42 33.27,42.42 37.85,37.85 38.35,37.85 40.64,35.56 v41.66,35.56 | 27.59,43.27 U$7.1 | U$2.1 46.08,43.43 D9.A 50.15,42.42 50.8,42.42 54.61,38.61 57.15,38.61 v59.18,40.64 | U$6.1 9.41,43.07 D7.A 13.54,42.16 16,42.16 17.78,40.39 17.78,38.86 19.81,36.83 v22.86,36.83 | 122.68,24.89 125.22,24.89 126.49,23.62 U$4.GND 126.49,6.35 125.22,5.08 | 125.22,5.08 U$4.AGND 123.95,3.3 121.92,1.27 104.9,1.27 | R2.2 97.16,2.16 98.04,1.27 99.82,1.27 | 104.9,1.27 102.36,1.27 | 102.36,1.27 99.82,1.27 | R4.2 99.69,1.4 99.82,1.27 | R6.2 102.23,1.4 102.36,1.27 | R8.2 104.78,1.4 104.9,1.27 | C2.1 113.92,27.82 113.92,28.07 | R9.1 122.94,7.37 125.22,5.08 | SOFTWARE_SHUTOFF.1 51.82,21.18 51.82,22.1 | 51.82,22.1 D10.A | R25.1 51.82,22.1 | 27.59,43.27 27.59,43.28 25.28,45.6 R19.2 22.49,48.39 R18.2 | 100.33,25.15 100.58,25.4 v100.58,26.16
  Bottom 0.305: 115.06,39.37 115.32,39.62 | D6.A IMD_SHUTDOWN.COIL+ D5.A
  Bottom 0.406: D4.A 101.75,35.81 U$1.2
  Bottom 0.61: SOFTWARE_SHUTOFF.1 58.29,23.08 58.31,23.08 61.72,26.49 IMD_SHUTDOWN1.COIL+ | v86.36,26.16 87.38,25.15 100.33,25.15 REG.4
  Bottom 1.778: 116.08,40.39 115.32,39.62 113.61,37.91 BUS2.2 | 123.26,40.89 123.26,58.86 115.95,66.17 X1.1 | 123.26,40.89 116.59,40.89 116.08,40.39 | BUS1.2 123.26,38.31 123.26,40.89 | 116.08,40.39 116.08,30.23 113.92,28.07 111,25.15 REG.2 REG.4
GND1
  Bottom 3.048: 25.3,59.44 37.34,59.44 | 37.34,59.44 55.56,59.44 55.81,59.18 | U$7.S 37.7,59.08 37.34,59.44
  Bottom 3.302: X3.10 49.39,71.77 55.81,65.34 55.81,59.18 55.81,53.81 U$2.S | 25.3,59.44 19.49,53.63 U$6.S
GPIO_1  (via drill 0.38)
  Top 0.254: U$10.2 54.3,8.95 55.32,9.98 GPIO_SSR1.3 54.16,10.29 47.75,16.7 47.75,19.56 46.74,20.57 42.42,20.57 v33.27,29.72 | v23.11,64.52 21.11,62.51 21.11,46.19 20.92,46 20.92,35.8 21.84,34.88 v21.84,34.29
  Bottom 0.254: v33.27,29.72 29.64,33.35 26.75,33.35 25.8,34.29 v21.84,34.29 | X3.6 23.11,69.89 v23.11,64.52
GPIO_CTRL1  (via drill 0.38)
  Top 0.254: GPIO_SSR1.1 51.05,11.11 U$10.1 52.44,6.35 54.61,6.35 58.67,10.41 81.03,10.41 83.82,10.41 v86.36,7.87 | U$4.A4 108.2,5.84 109.47,5.84 109.98,6.35 109.98,8.13 109.73,8.38 88.65,8.38 v88.14,7.87
  Bottom 0.254: v88.14,7.87 v86.36,7.87
IMD_COIL_PWR  (via drill 0.38)
  Top 0.254: 63.75,55.12 58.17,49.53 58.17,35.04 R14.1 62.73,34.29 v63.25,34.29 | IMD_LATCH_SSR.3 81.79,25.73 v81.79,26.67
  Top 0.406: IMD_SHUTDOWN.COIL- 63.75,55.12 65.53,53.34 83.06,53.34 IMD_SHUTDOWN.4
  Bottom 0.254: v63.25,34.29 67.31,38.35 77.72,38.35 79.86,36.22 79.86,33.53 79.26,32.93 79.22,32.93 78.36,32.07 78.36,30.1 v81.79,26.67
  Bottom 0.305: D6.C IMD_SHUTDOWN.COIL-
IMD_PWR_STEP  (via drill 0.38)
  Top 0.254: v79.25,26.42 80.64,27.81 IMD_LATCH_SSR.4 84.45,27.81 v84.58,27.94 | v66.04,26.42 66.04,25.35 IMD_SSR.3 | IMD_SHUTDOWN.3 83.64,47.75 87.88,47.75 88.39,47.24 v88.39,39.37
  Bottom 0.254: v66.04,26.42 68.83,26.42 70.87,24.38 77.22,24.38 v79.25,26.42 | v88.39,39.37 88.39,33.85 84.68,30.14 84.68,28.04 v84.58,27.94
INVERTER_CTRL
  Bottom 0.254: 107.95,19.81 U$4.D6 106.17,21.59 96.84,21.59 96.69,21.74 88.24,21.74 85.34,24.64 85.34,30.23 89.66,34.54 89.66,38.56 INVERTER_SSR.1
INVERTER_SUPPLY
  Top 1.778: X3.5 46.01,64.52 85.6,64.52 89.15,60.96 95.76,60.96 98.04,58.67 98.04,50.29 101.73,46.61 U$1.S
LATCH_EXT_BUTTON  (via drill 0.38)
  Top 0.254: S1.A1 S1.A2 89.12,34.29 | 89.12,34.29 89.12,51.09 84.07,56.13 84.07,59.69 81.28,62.48 v80.52,62.48 | LED2.C 75.18,29.72 76.45,30.99 78.77,30.99 LED1.C 81.28,29.72 v81.79,30.23 | v83.06,34.29 89.12,34.29
  Bottom 0.254: v81.79,30.23 81.79,33.02 v83.06,34.29
  Bottom 0.406: X1.8 80.72,62.48 v80.52,62.48
N$1
  Top 0.254: LED1.A 76.45,29.72 75.18,28.45 75.18,26.34 IMD_LATCH_SSR.2
N$2
  Bottom 0.254: 120.14,22.1 CAN_TRANSCEIVER.4 117.8,23.05 U$4.D4(CANRX)
N$3
  Bottom 0.254: CAN_TRANSCEIVER.1 123.95,21.59 123.7,21.34 118.36,21.34 116.33,19.3 U$4.D3(CANTX)
N$4
  Bottom 0.254: D7.C 14.48,43.07 | 14.48,43.07 17.59,43.07 U$6.2 | PUMP_SSR.3 12.19,47.5 13.46,46.23 13.46,44.09 14.48,43.07
N$5
  Top 0.254: R12.1 78.22,25.84 IMD_LATCH_SSR.1
N$6
  Top 0.254: GPIO_SSR1.2 47.93,11.68 R29.1
N$7
  Top 0.254: BRAKE_LIGHT_SSR.2 3.81,30.23 5.17,28.86 LED4.A
N$9
  Top 0.254: LED3.A 59.74,15.41 BMS_SSR.2
N$10
  Top 0.254: LED10.A 9.65,22.1 12.7,25.15
  Top 0.305: 12.7,25.15 22.82,25.15 XB.15
N$11
  Top 0.305: LED10.C 5.01,17.65 R22.2
N$12
  Top 0.254: R13.2 70.09,25.84 BMS_LATCH_SSR.1
N$13
  Top 0.254: R29.2 LED14.A
N$15
  Bottom 0.254: BOARD_TEMP.2 R9.2 114.69,9.79 U$4.A5
N$16
  Top 0.254: BMS_LATCH_SSR.2 67.24,26.15 67.24,28.33 68.63,29.72 LED2.A
N$17
  Bottom 0.254: R10.1 4.71,32.77 BRAKE_LIGHT_SSR.1
N$18
  Top 0.254: R11.1 59.74,18.47 BMS_SSR.1
N$19
  Top 0.254: LED5.A R14.2
N$20
  Bottom 0.254: U$7.2 35.54,43.55 D8.C 31.5,44.77 31.5,46.74 30.35,47.88 FAN_SSR1.3
N$21
  Bottom 0.254: D9.C 51.05,43.43 | 51.05,43.43 54,43.43 U$2.2 | FAN_SSR2.3 48.77,48.01 50.29,46.48 50.29,44.2 51.05,43.43
N$22
  Bottom 0.254: R1.1 94.36,13.47 D1.C
N$23
  Bottom 0.254: R3.1 97.17,14.73 D2.C
N$24
  Bottom 0.254: R5.1 100.59,13.84 D3.C
N$25
  Top 0.254: 7.86,3.05 22.73,3.05 XB.6
  Top 0.305: LED11.A 7.86,3.05
N$26
  Bottom 0.406: U$1.1 92.56,35.81 D4.C 96.76,37.12 INVERTER_SSR.3
N$27  (via drill 0.38)
  Top 0.254: R16.1 92.7,36.82 v98.3,42.42
  Bottom 0.254: INVERTER_SSR.2 98.3,44.66 v98.3,42.42
N$28
  Top 0.406: R16.2 LED6.A
N$29
  Top 0.254: R20.2 124.55,26.67 LED8.A
N$30
  Top 0.254: LED16.C R24.1
N$31
  Top 0.254: IMD_SSR.1 60.12,28.12 R21.2
N$32
  Top 0.254: LED7.A R17.2
N$33
  Top 0.305: R23.2 4.93,8.08 LED11.C
N$34
  Top 0.254: LED9.A 62.07,23.32 IMD_SSR.2
N$35
  Top 0.457: C6.2 36.32,18.56 REG2.3 32.63,18.8 25.15,18.8 24.72,18.37 REG1.3 20.01,18.55 C3.1
N$36
  Top 0.254: LED13.C R28.1
N$37
  Top 0.254: LED12.C R27.1
N$38  (via drill 0.38)
  Top 0.254: LED12.A 11.21,43.72 v11.43,43.94
  Bottom 0.254: v11.43,43.94 12.19,44.7 PUMP_SSR.2
N$39  (via drill 0.38)
  Top 0.406: LED16.A 48.29,36.83 48.26,36.83 47.75,37.34 v47.75,44.96
  Bottom 0.254: FAN_SSR2.2 47.75,45.01 v47.75,44.96
N$40
  Top 0.254: LED18.A R31.2
N$42  (via drill 0.38)
  Top 0.254: v29.46,44.7 29.88,44.29 LED13.A
  Bottom 0.254: FAN_SSR1.2 29.46,44.88 v29.46,44.7
N$43
  Top 0.254: SOFTWARE_SHUTOFF.2 52.82,32.16 R26.1
  Bottom 0.406: D10.C 50.47,27.14 50.47,27.25
  Bottom 0.61: SOFTWARE_SHUTOFF.2 50.47,27.25 49.74,26.52 U$5.3
N$44
  Bottom 0.254: R25.2 44.7,26.16 U$5.2
N$46
  Top 0.254: R26.2 LED17.A
OKHS  (via drill 0.38)
  Top 0.254: R21.1 60.97,26.92 52.32,26.92 52.07,27.18 v39.88,27.18 | v38.86,26.16 44.04,20.98 46.9,20.98 48.16,19.73 48.16,16.87 53.85,11.18 77.98,11.18 79.22,12.41 82.01,12.41 83.41,11.01 85.11,11.01 85.28,11.18 v86.36,11.18
  Top 0.406: X3.1 17.02,61.71 v17.02,48.51 17.02,33.53 17.53,33.02 32,33.02 v38.86,26.16
  Bottom 0.254: D1.A 89.52,11.18 v86.36,11.18 | v39.88,27.18 v38.86,26.16 | R18.1 17.14,48.39 v17.02,48.51
OKHS_READ
  Bottom 0.254: R1.2 95.89,9.65 | 95.89,9.65 95.89,3.94 U$4.A0 | 97.04,9.65 95.89,9.65
  Bottom 0.406: R2.1 97.04,9.65
PUMP1-
  Top 1.27: X3.7 24.14,68.83 19.3,68.83 13.5,63.03 U$6.P
RELAY_CTRL1  (via drill 0.38)
  Top 0.254: v93.73,9.65 113.03,9.65 U$4.A9
  Bottom 0.254: v93.73,9.65 91.44,9.65 91.08,10.01 84.41,10.01 81.97,12.45 79.5,12.45 77.72,10.67 77.22,10.67 53.34,10.67 46.74,17.27 46.23,17.27 44.45,19.05 44.45,19.56 30.23,33.78
  Bottom 0.305: PUMP_SSR.1 18.72,45.39 18.8,45.47 23.11,41.15 23.11,37.59 26.92,33.78 30.23,33.78
RELAY_CTRL2  (via drill 0.38)
  Top 0.254: v92.46,10.41 105.66,10.41 110.24,10.41 U$4.D2
  Bottom 0.254: FAN_SSR1.1 33.2,45.47 38.61,45.47 41.91,42.16 41.91,37.08 44.7,34.29 44.7,29.72 41.78,26.8 41.78,23.37 41.78,23.24 41.78,22.8 44.86,19.73 44.86,19.3 46.48,17.68 47.35,17.68 52.96,12.06 78.23,12.06 79.2,13.04 81.96,13.04 84.58,10.41 v92.46,10.41
RELAY_CTRL3  (via drill 0.38)
  Top 0.254: U$4.A8 114.3,1.78 87.38,1.78 87.12,2.03 87.12,30.48 83.98,33.62 82.78,33.62 81.85,34.54 78.74,34.54 78.23,35.05 78.23,37.85 76.45,39.62 68.58,39.62 66.55,41.66 v60.45,41.66
  Bottom 0.254: v60.45,41.66 56.09,46.02 FAN_SSR2.1
SHUTDOWN_A
  Bottom 1.778: IMD_SHUTDOWN.6 84.78,60.2 89.76,60.2 SHUTDWN_FUSE.L1 SHUTDWN_FUSE.L2
SHUTDOWN_B
  Bottom 1.778: IMD_SHUTDOWN.5 86.74,54.99 84.33,52.58 84.33,46.28 IMD_SHUTDOWN1.6
SHUTDOWN_C
  Bottom 0.254: D3.A 97.28,18.02 97.28,20.57 96.52,21.34 87.88,21.34 83.76,25.46 83.76,40.7
  Bottom 1.778: IMD_SHUTDOWN1.5 83.76,40.7 82.68,39.62 60.71,39.62 58.93,37.85 58.93,27.61 SOFTWARE_SHUTOFF.P
SHUTDOWN_D
  Top 0.254: R31.1 38.36,35.31 40.13,35.31
  Top 1.778: SOFTWARE_SHUTOFF.S 40.13,32.66 40.13,35.31 40.13,59.18 33.39,65.93 X3.3
SHUTDOWN_OUT_READ
  Bottom 0.254: R5.2 100.97,9.65 | 100.97,9.65 100.97,3.94 U$4.A2 | R6.1 101.08,9.53 100.97,9.65
SOFTWARE_SHUTDOWN  (via drill 0.38)
  Top 0.254: v88.65,14.73 91.44,14.73 91.69,14.48 91.69,9.14 91.95,8.89 109.98,8.89 113.79,5.08 U$4.A7
  Bottom 0.254: v88.65,14.73 82.3,14.73 82.04,14.99 52.37,14.99 49.07,18.29 46.8,18.29 46.32,18.77 46.32,19.72 43.74,22.3 U$5.1
VCC  (via drill 0.38)
  Top 0.457: REG1.2 20.25,16.12 22.1,16.12 | 22.1,16.12 C4.2 | 22.1,16.12 v22.1,15.24 | REG1.4 14.91,15.05 XB.1
  Bottom 0.457: v22.1,15.24 14.91,8.05 XB.1
XB8  (via drill 0.38)
  Top 0.254: U$4.D7(RX3) 109.98,15.24 v109.98,11.68 | v108.97,6.6 107.76,6.6 106.75,5.59 92.2,5.59 91.19,6.6 v90.68,6.6
  Bottom 0.254: v108.97,6.6 109.98,7.62 v109.98,11.68 | XB.4 23.04,7.37 36.32,7.37 37.34,6.35 78.8,6.35 79.73,7.28 82.57,7.28 83.92,5.93 90,5.93 v90.68,6.6
XBDI  (via drill 0.38)
  Top 0.254: U$4.D10(TX2) v105.66,11.94 | v106.43,7.37 89.15,7.37 v88.39,6.6
  Bottom 0.254: v105.66,11.94 106.43,11.18 v106.43,7.37 | v88.39,6.6 83.82,6.6 82.55,7.87 21.55,7.87 XB.3
XBDO  (via drill 0.38)
  Top 0.254: U$4.D9(RX2) 107.95,12.19 v107.95,11.94 | v107.95,7.37 106.93,6.35 v93.47,6.35
  Bottom 0.254: v107.95,11.94 v107.95,7.37 | v93.47,6.35 92.54,5.42 80.52,5.42 40.22,5.42 38.86,4.06 18.08,4.06 XB.2
(copper drawn outside any net)
  shapes: Top area x2

### Text on the board
tDocu: Fan1 | Fan2 | Pump1 | IMD | IMD LATCH | BMS | GPIO2 | 5V Power | GPIO1 | Latch BTN
bDocu: BMS Latch